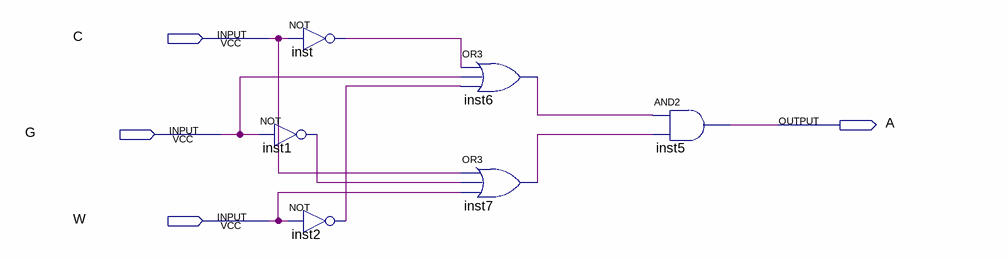
[diagram p0: schematic sheet]
// Quartus schematic lab3step0.bdf as structural Verilog: 6 symbols, 4 pins
module lab3step0 (
  input  C,
  input  G,
  input  W,
  output A
);

  wire inst1_out, inst2_out, inst6_out, inst7_out, inst_out;

  not inst (inst_out, C);
  not inst1 (inst1_out, G);
  not inst2 (inst2_out, W);
  or inst6 (inst6_out, inst_out, G, inst2_out);
  or inst7 (inst7_out, C, inst1_out, W);
  and inst5 (A, inst6_out, inst7_out);
endmodule
